# Altium schematic sheet ControllerV1.SchDoc
size A4
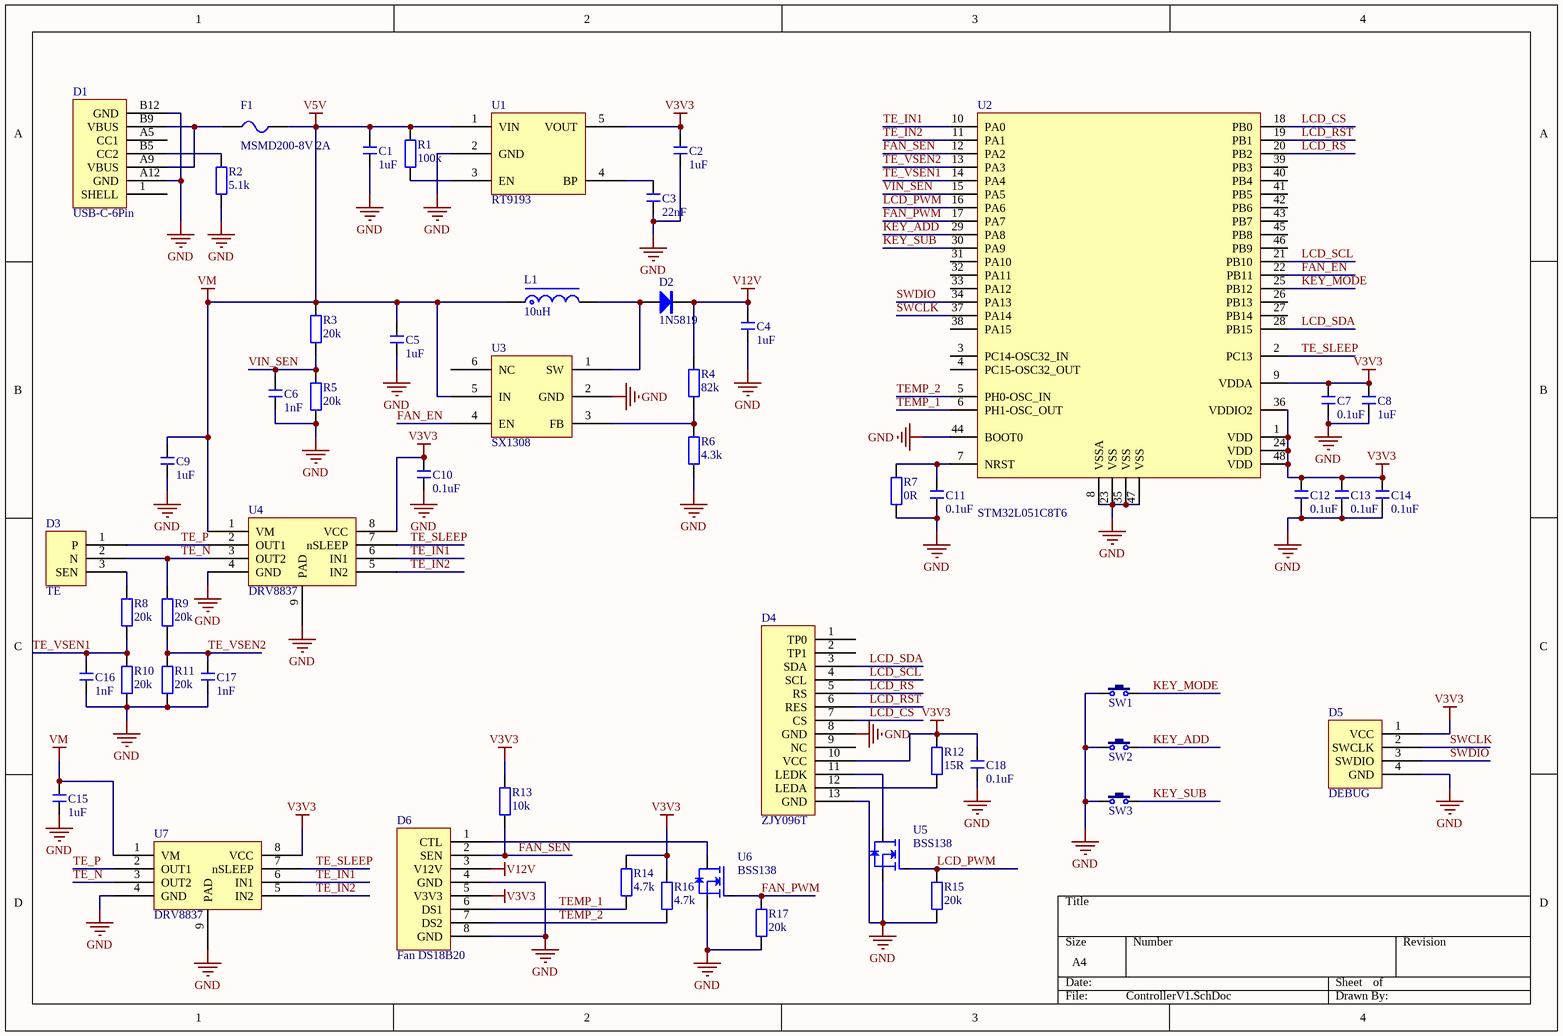
[diagram p0: ControllerV1.SchDoc]

## Parts
C1  1uF  [C 0603_L]
C2  1uF  [C 0603_L]
C3  22nF  [C 0603_L]
C4  1uF  [C 0603_L]
C5  1uF  [C 0603_L]
C6  1nF  [C 0603_L]
C7  0.1uF  [C 0603_L]
C8  1uF  [C 0603_L]
C9  1uF  [C 0603_L]
C10  0.1uF  [C 0603_L]
C11  0.1uF  [C 0603_L]
C12  0.1uF  [C 0603_L]
C13  0.1uF  [C 0603_L]
C14  0.1uF  [C 0603_L]
C15  1uF  [C 0603_L]
C16  1nF  [C 0603_L]
C17  1nF  [C 0603_L]
C18  0.1uF  [C 0603_L]
D1  USB-C-6Pin  [USB-C-6Pin-InBoard]
D2  1N5819  [SOD-323]
D3  TE  [TE]
D4  ZJY096T  [LCD_0p96_ZJY096T]
D5  DEBUG  [DBG]
D6  Fan DS18B20  [Connector Fan DS18B20]
F1  MSMD200-8V 2A  [FU 1206]
L1  10uH  [NR4020]
R1  100k  [R 0603_L]
R2  5.1k  [R 0603_L]
R3  20k  [R 0603_L]
R4  82k  [R 0603_L]
R5  20k  [R 0603_L]
R6  4.3k  [R 0603_L]
R7  0R  [R 0603_L]
R8  20k  [R 0603_L]
R9  20k  [R 0603_L]
R10  20k  [R 0603_L]
R11  20k  [R 0603_L]
R12  15R  [R 0603_L]
R13  10k  [R 0603_L]
R14  4.7k  [R 0603_L]
R15  20k  [R 0603_L]
R16  4.7k  [R 0603_L]
R17  20k  [R 0603_L]
SW1  3x6x5  [TSW SMD-3*6*5]  (value not drawn)
SW2  3x6x5  [TSW SMD-3*6*5]  (value not drawn)
SW3  3x6x5  [TSW SMD-3*6*5]  (value not drawn)
U1  RT9193  [SOT23-5 RT9193]
U2  STM32L051C8T6  [LQFP48]
U3  SX1308  [SOT23-6 SX1308]
U4  DRV8837  [WSON-8 DRV8837]
U5  BSS138  [SOT23-3 BSS138]
U6  BSS138  [SOT23-3 BSS138]
U7  DRV8837  [WSON-8 DRV8837]

## Nets
GND: C1.1 C2.1 C3.1 C4.1 C5.1 C6.1 C7.1 C8.1 C9.1 C10.1 C11.1 C12.1 C13.1 C14.1 C15.1 C16.1 C17.1 C18.1 D1.A12(GND) D1.B12(GND) D4.8(GND) D4.13(GND) D5.4(GND) D6.4(GND) D6.8(GND) R2.1 R5.1 R6.1 R7.1 R10.1 R11.1 R15.1 R17.1 SW1.1 SW2.1 SW3.1 U1.2(GND) U2.8(VSSA) U2.23(VSS) U2.35(VSS) U2.44(BOOT0) U2.47(VSS) U3.2(GND) U4.4(GND) U4.9(PAD) U5.2(S) U6.2(S) U7.4(GND) U7.9(PAD)
V3V3: C2.2 C7.2 C8.2 C10.2 C12.2 C13.2 C14.2 C18.2 D4.10(VCC) D5.1(VCC) D6.5(V3V3) R12.2 R13.2 R14.2 R16.2 U1.5(VOUT) U2.1(VDD) U2.9(VDDA) U2.24(VDD) U2.36(VDDIO2) U2.48(VDD) U4.8(VCC) U7.8(VCC)
V5V: C1.2 C5.2 C9.2 C15.2 F1.2 L1.1 R1.2 R3.2 U1.1(VIN) U3.5(IN) U4.1(VM) U7.1(VM)  [also labelled VM]
V12V: C4.2 D2.2(K) D6.3(V12V) R4.2
FAN_EN: U2.22(PB11) U3.4(EN)
FAN_PWM: R17.2 U2.17(PA7) U6.1(G)
FAN_SEN: D6.2(SEN) R13.1 U2.12(PA2)
KEY_ADD: SW2.2 U2.29(PA8)
KEY_MODE: SW1.2 U2.25(PB12)
KEY_SUB: SW3.2 U2.30(PA9)
LCD_CS: D4.7(CS) U2.18(PB0)
LCD_PWM: R15.2 U2.16(PA6) U5.1(G)
LCD_RS: D4.5(RS) U2.20(PB2)
LCD_RST: D4.6(RES) U2.19(PB1)
LCD_SCL: D4.4(SCL) U2.21(PB10)
LCD_SDA: D4.3(SDA) U2.28(PB15)
SWCLK: D5.2(SWCLK) U2.37(PA14)
SWDIO: D5.3(SWDIO) U2.34(PA13)
TE_IN1: U2.10(PA0) U4.6(IN1) U7.6(IN1)
TE_IN2: U2.11(PA1) U4.5(IN2) U7.5(IN2)
TE_N: D3.2(N) R9.2 U4.3(OUT2) U7.3(OUT2)
TE_P: D3.1(P) U4.2(OUT1) U7.2(OUT1)
TE_SLEEP: U2.2(PC13) U4.7(nSLEEP) U7.7(nSLEEP)
TE_VSEN1: C16.2 R8.1 R10.2 U2.14(PA4)
TE_VSEN2: C17.2 R9.1 R11.2 U2.13(PA3)
TEMP_1: D6.6(DS1) R14.1 U2.6(PH1-OSC_OUT)
TEMP_2: D6.7(DS2) R16.1 U2.5(PH0-OSC_IN)
VIN_SEN: C6.2 R3.1 R5.2 U2.15(PA5)
NetC3_2: C3.2 U1.4(BP)
NetC11_2: C11.2 R7.2 U2.7(NRST)
NetD1_A9: D1.A9(VBUS) D1.B9(VBUS) F1.1
NetD1_B5: D1.B5(CC2) R2.2
NetD2_1: D2.1(A) L1.2 U3.1(SW)
NetD3_3: D3.3(SEN) R8.2
NetD4_11: D4.11(LEDK) U5.3(D)
NetD4_12: D4.12(LEDA) R12.1
NetD6_1: D6.1(CTL) U6.3(D)
NetR1_1: R1.1 U1.3(EN)
NetR4_1: R4.1 R6.2 U3.3(FB)

Not connected (* = marked no-connect by the designer): D1 1(SHELL) A5(CC1); D4 1(TP0) 2(TP1) 9(NC); U2 3(PC14-OSC32_IN) 4(PC15-OSC32_OUT) 26(PB13) 27(PB14) 31(PA10) 32(PA11) 33(PA12) 38(PA15) 39(PB3) 40(PB4) 41(PB5) 42(PB6) 43(PB7) 45(PB8) 46(PB9); U3 6(NC)

## Library data of the parts
C1-C18 = C: 无极性贴片电容; 版权归属: 源创客; BOM名称: 无极性贴片电容; 学习资源: www.ooocke.com
D2 = 1N5819: 肖特基二极管; 版权归属: 源创客; 属性: 40V/2A; BOM名称: 肖特基二极管; 学习资源: www.ooocke.com
D4 = LCD_0p96_ZJY096T
D5 = DBG
D6 = Connecter Fan DS18B20
F1 = FU: 贴片保险丝; 版权归属: 源创客; BOM名称: 贴片保险丝; 学习资源: www.ooocke.com
L1 = L-NR: NR磁胶电感; 版权归属: 源创客; BOM名称: NR磁胶电感; 学习资源: www.ooocke.com
R1-R17 = R: 贴片电阻; 版权归属: 源创客; BOM名称: 贴片电阻; 学习资源: www.ooocke.com
SW1-SW3 = TSW 3x6: 3x6轻触开关; 版权归属: 源创客; BOM名称: 3x6轻触开关; 学习资源: www.ooocke.com